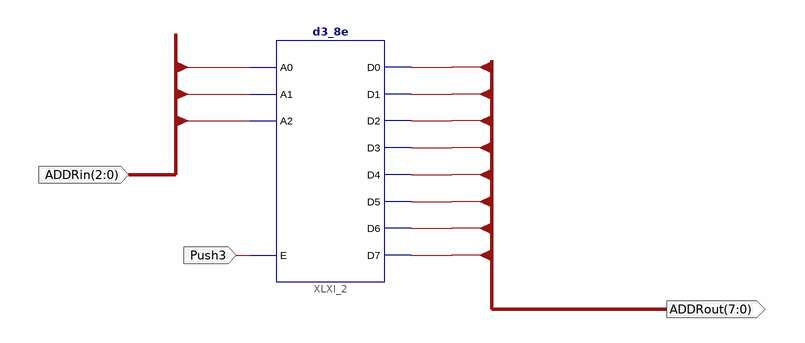
[diagram p0: schematic sheet 1]
// Xilinx ISE schematic REG.sch (spartan3e) as structural Verilog: 1 symbols, 3 ports
module REG (
  input  Push3,
  input  [2:0] ADDRin,
  output [7:0] ADDRout
);

  d3_8e XLXI_2 (
    .A0(ADDRin[0]), .A1(ADDRin[1]), .A2(ADDRin[2]), .E(Push3), .D0(ADDRout[0]), .D1(ADDRout[1]),
    .D2(ADDRout[2]), .D3(ADDRout[3]), .D4(ADDRout[4]), .D5(ADDRout[5]), .D6(ADDRout[6]), .D7(ADDRout[7]));
endmodule
